# Altium schematic sheet Sheet1.SchDoc
size A1; SheetNumber: 1; SheetTotal: 1
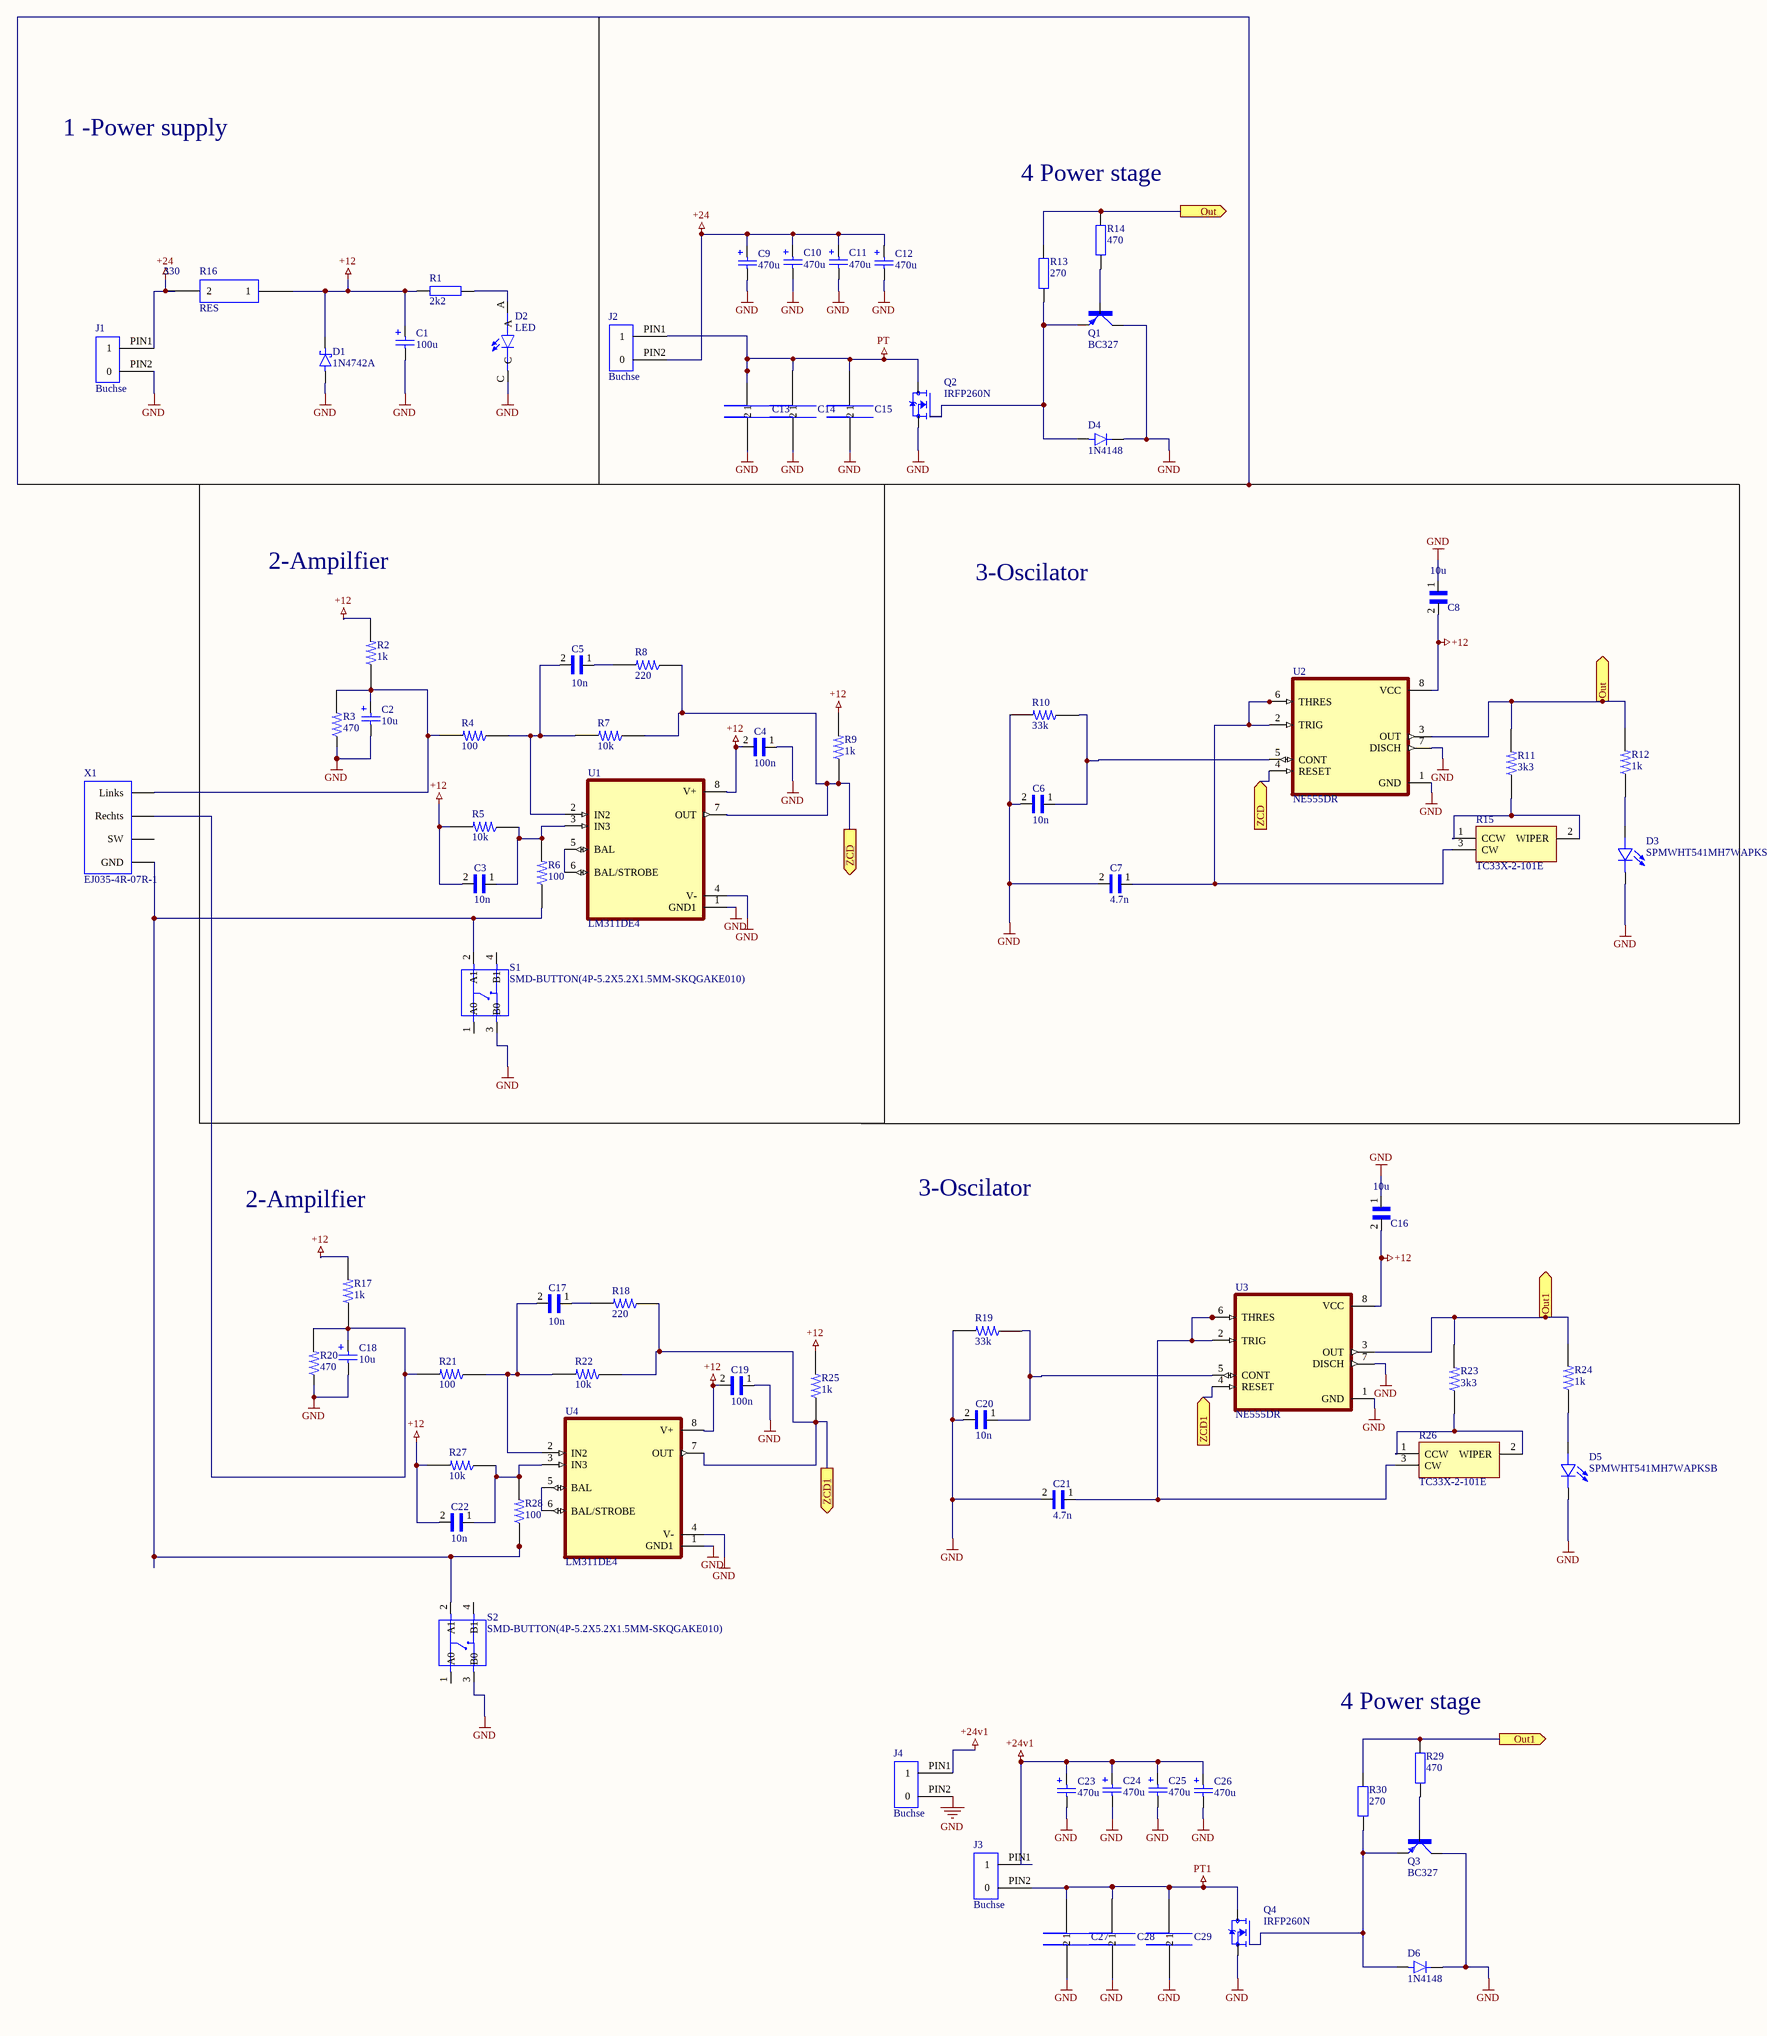
[diagram p0: Sheet1.SchDoc]

## Parts
C1  value 100u  [RB-.1/.2]  (hidden comment: ELKO)
C2  value 10u  [RB-.1/.2]  (hidden comment: ELKO)
C3  value 10n  [CAPC2012X135N]  (hidden comment: GCM21BR71H104KA37K)
C4  value 100n  [CAPC2012X135N]  (hidden comment: GCM21BR71H104KA37K)
C5  value 10n  [CAPC2012X135N]  (hidden comment: GCM21BR71H104KA37K)
C6  value 10n  [CAPC2012X135N]  (hidden comment: GCM21BR71H104KA37K)
C7  value 4.7n  [CAPC2012X135N]  (hidden comment: GCM21BR71H104KA37K)
C8  10u  [CAPC2012X135N]
C9  value 470u  [RB-.2/.4]  (hidden comment: ELKO)
C10  value 470u  [RB-.2/.4]  (hidden comment: ELKO)
C11  value 470u  [RB-.2/.4]  (hidden comment: ELKO)
C12  value 470u  [RB-.2/.4]  (hidden comment: ELKO)
C13  Kondensator  [Co]  (value not drawn)
C14  Kondensator  [Co]  (value not drawn)
C15  Kondensator  [Co]  (value not drawn)
C16  10u  [CAPC2012X135N]
C17  value 10n  [CAPC2012X135N]  (hidden comment: GCM21BR71H104KA37K)
C18  value 10u  [RB-.1/.2]  (hidden comment: ELKO)
C19  value 100n  [CAPC2012X135N]  (hidden comment: GCM21BR71H104KA37K)
C20  value 10n  [CAPC2012X135N]  (hidden comment: GCM21BR71H104KA37K)
C21  value 4.7n  [CAPC2012X135N]  (hidden comment: GCM21BR71H104KA37K)
C22  value 10n  [CAPC2012X135N]  (hidden comment: GCM21BR71H104KA37K)
C23  value 470u  [RB-.2/.4]  (hidden comment: ELKO)
C24  value 470u  [RB-.2/.4]  (hidden comment: ELKO)
C25  value 470u  [RB-.2/.4]  (hidden comment: ELKO)
C26  value 470u  [RB-.2/.4]  (hidden comment: ELKO)
C27  Kondensator  [Co]  (value not drawn)
C28  Kondensator  [Co]  (value not drawn)
C29  Kondensator  [Co]  (value not drawn)
D1  1N4742A  [DIOAD1036W78L463D272]
D2  LED  [LED_WP7113ID]
D3  SPMWHT541MH7WAPKSB  [LED_SPMWHT541MH7WAPKSB]
D4  1N4148  [DIOAD753W49L380D172B]
D5  SPMWHT541MH7WAPKSB  [LED_SPMWHT541MH7WAPKSB]
D6  1N4148  [DIOAD753W49L380D172B]
J1  Buchse  [Buchse1]
J2  Buchse  [Buchse1]
J3  Buchse  [Buchse1]
J4  Buchse  [Buchse1]
Q1  BC327  [SOT54A]
Q2  IRFP260N  [TO545P1560X500X2460-3]
Q3  BC327  [SOT54A]
Q4  IRFP260N  [TO545P1560X500X2460-3]
R1  value 2k2  [Axial-0.4]  (hidden comment: 1/8W)
R2  value 1k  [RESC1607X60N]  (hidden comment: RC0603FR-071ML)
R3  value 470  [RESC1607X60N]  (hidden comment: RC0603FR-071ML)
R4  value 100  [RESC1607X60N]  (hidden comment: RC0603FR-071ML)
R5  value 10k  [RESC1607X60N]  (hidden comment: RC0603FR-071ML)
R6  value 100  [RESC1607X60N]  (hidden comment: RC0603FR-071ML)
R7  value 10k  [RESC1607X60N]  (hidden comment: RC0603FR-071ML)
R8  value 220  [RESC1607X60N]  (hidden comment: RC0603FR-071ML)
R9  value 1k  [RESC1607X60N]  (hidden comment: RC0603FR-071ML)
R10  value 33k  [RESC1607X60N]  (hidden comment: RC0603FR-071ML)
R11  value 3k3  [RESC1607X60N]  (hidden comment: RC0603FR-071ML)
R12  value 1k  [RESC1607X60N]  (hidden comment: RC0603FR-071ML)
R13  value 270  [Axial-0.4]  (hidden comment: 1/4W)
R14  value 470  [Axial-0.4]  (hidden comment: 1/8W)
R15  TC33X-2-101E  [TC33X2503E]
R16  RES  VALUE=: 330  [PCBComponent_1]
R17  value 1k  [RESC1607X60N]  (hidden comment: RC0603FR-071ML)
R18  value 220  [RESC1607X60N]  (hidden comment: RC0603FR-071ML)
R19  value 33k  [RESC1607X60N]  (hidden comment: RC0603FR-071ML)
R20  value 470  [RESC1607X60N]  (hidden comment: RC0603FR-071ML)
R21  value 100  [RESC1607X60N]  (hidden comment: RC0603FR-071ML)
R22  value 10k  [RESC1607X60N]  (hidden comment: RC0603FR-071ML)
R23  value 3k3  [RESC1607X60N]  (hidden comment: RC0603FR-071ML)
R24  value 1k  [RESC1607X60N]  (hidden comment: RC0603FR-071ML)
R25  value 1k  [RESC1607X60N]  (hidden comment: RC0603FR-071ML)
R26  TC33X-2-101E  [TC33X2503E]
R27  value 10k  [RESC1607X60N]  (hidden comment: RC0603FR-071ML)
R28  value 100  [RESC1607X60N]  (hidden comment: RC0603FR-071ML)
R29  value 470  [Axial-0.4]  (hidden comment: 1/8W)
R30  value 270  [Axial-0.4]  (hidden comment: 1/4W)
S1  SMD-BUTTON(4P-5.2X5.2X1.5MM-SKQGAKE010)  [SW4-SMD-5.2X5.2X1.5MM]
S2  SMD-BUTTON(4P-5.2X5.2X1.5MM-SKQGAKE010)  [SW4-SMD-5.2X5.2X1.5MM]
U1  LM311DE4  [SOIC127P599X175-8N]
U2  NE555DR  [SOIC127P599X175-8N]
U3  NE555DR  [SOIC127P599X175-8N]
U4  LM311DE4  [SOIC127P599X175-8N]
X1  EJ035-4R-07R-1  [EJ035-4R-07R-1]

## Ports
Out1 (out), Out (out), ZCD1 (in), ZCD1 (out), ZCD (in), ZCD (out)

## Nets
+12: C1.1 C3.2 C4.2 C8.2 C16.2 C19.2 C22.2 D1.1(K) R1.1 R2.2 R5.2 R9.2 R16.PIN1(1) R17.2 R25.2 R27.2 U1.8(V+) U2.8(VCC) U3.8(VCC) U4.8(V+)
+24: C9.1 C10.1 C11.1 C12.1 J1.PIN1(1) J2.PIN2(0) R16.PIN2(2)
+24v1: C23.1 C24.1 C25.1 C26.1 J3.PIN1(1) J4.PIN1(1)
GND: C1.2 C2.2 C4.1 C6.2 C7.2 C8.1 C9.2 C10.2 C11.2 C12.2 C13.PIN1(1) C14.PIN1(1) C15.PIN1(1) C16.1 C18.2 C19.1 C20.2 C21.2 C23.2 C24.2 C25.2 C26.2 C27.PIN1(1) C28.PIN1(1) C29.PIN1(1) D1.2(A) D2.C D3.C D4.K D5.C D6.K J1.PIN2(0) J4.PIN2(0) Q1.C Q2.3(S) Q3.C Q4.3(S) R3.1 R10.2 R19.2 R20.1 S1.3(B0) S2.3(B0) U1.1(GND1) U1.4(V-) U2.1(GND) U2.7(DISCH) U3.1(GND) U3.7(DISCH) U4.1(GND1) U4.4(V-)
PT: C13.PIN2(2) C14.PIN2(2) C15.PIN2(2) J2.PIN1(1) Q2.2(D)
PT1: C27.PIN2(2) C28.PIN2(2) C29.PIN2(2) J3.PIN2(0) Q4.2(D)
Out: R11.2 R12.2 R13.2 R14.2 U2.3(OUT) ; port Out
Out1: R23.2 R24.2 R29.2 R30.2 U3.3(OUT) ; port Out1
ZCD: R7.1 R8.1 R9.1 U1.7(OUT) U2.4(RESET) ; port ZCD
ZCD1: R18.1 R22.1 R25.1 U3.4(RESET) U4.7(OUT) ; port ZCD1
NetC2_1: C2.1 R2.1 R3.2 R4.2 X1.L(Links)
NetC3_1: C3.1 R5.1 R6.2 U1.3(IN3)
NetC5_1: C5.1 R8.2
NetC5_2: C5.2 R4.1 R7.2 U1.2(IN2)
NetC6_1: C6.1 R10.1 U2.5(CONT)
NetC7_1: C7.1 R15.3(CW) U2.2(TRIG) U2.6(THRES)
NetC17_1: C17.1 R18.2
NetC17_2: C17.2 R21.1 R22.2 U4.2(IN2)
NetC18_1: C18.1 R17.1 R20.2 R21.2 X1.R(Rechts)
NetC20_1: C20.1 R19.1 U3.5(CONT)
NetC21_1: C21.1 R26.3(CW) U3.2(TRIG) U3.6(THRES)
NetC22_1: C22.1 R27.1 R28.2 U4.3(IN3)
NetD2_A: D2.A R1.2
NetD3_A: D3.A R12.1
NetD4_A: D4.A Q1.E Q2.1(G) R13.1
NetD5_A: D5.A R24.1
NetD6_A: D6.A Q3.E Q4.1(G) R30.1
NetQ1_B: Q1.B R14.1
NetQ3_B: Q3.B R29.1
NetR6_1: R6.1 R28.1 S1.2(A1) S2.2(A1) X1.GND
NetR11_1: R11.1 R15.1(CCW) R15.2(WIPER)
NetR23_1: R23.1 R26.1(CCW) R26.2(WIPER)
NetU1_5: U1.5(BAL) U1.6(BAL/STROBE)
NetU4_5: U4.5(BAL) U4.6(BAL/STROBE)

Not connected (* = marked no-connect by the designer): S1 1(A0) 4(B1); S2 1(A0) 4(B1); X1 SW

## Notes on the sheet
- 1 -Power supply
- (near R14) 4 Power stage
- 2-Ampilfier
- 3-Oscilator
- (near R29) 4 Power stage

## Library data of the parts
C3 C4 C6-C8 C16 C19-C22 = GCM21BR71H104KA37K: SMD Capacitor X7R(EIA) with Capacitance: 0.10uF Tol. 10%. Rated Voltage: 50Vdc; MF: Murata; SnapEDA_Link: https://www.snapeda.com/parts/GCM21BR71H104KA37K/Murata%20Electronics%20North%20America/view-part/1764792/?ref=snap; MP: GCM21BR71H104KA37K; Price: None; Arrow_Electronics-Purchase-URL: https://snapeda.com/shop?store=Arrow+Electronics&id=1764792; Availability: Good; Package: 0805 Murata; DigiKey-Purchase-URL: https://snapeda.com/shop?store=DigiKey&id=1764792; Check_prices: https://www.snapeda.com/parts/GCM21BR71H104KA37K/Murata%20Electronics%20North%20America/view-part/1764792/?ref=eda
  C8 C16: Value: 10u
C5 C17 = GCM21BR71H104KA37K: MF: Murata; SnapEDA_Link: https://www.snapeda.com/parts/GCM21BR71H104KA37K/Murata%20Electronics%20North%20America/view-part/1764792/?ref=snap; MP: GCM21BR71H104KA37K; Price: None; Arrow_Electronics-Purchase-URL: https://snapeda.com/shop?store=Arrow+Electronics&id=1764792; Availability: Good; Package: 0805 Murata; DigiKey-Purchase-URL: https://snapeda.com/shop?store=DigiKey&id=1764792; Check_prices: https://www.snapeda.com/parts/GCM21BR71H104KA37K/Murata%20Electronics%20North%20America/view-part/1764792/?ref=eda
D1 = 1N4742A: Zener Diode 12 V 1 W Â±5% Through Hole DO-41; MF: ON; SnapEDA_Link: https://www.snapeda.com/parts/1N4742A/Onsemi/view-part/?ref=snap; Package: DO-41 ON Semiconductor; Value: *; MP: 1N4742A; Check_prices: https://www.snapeda.com/parts/1N4742A/Onsemi/view-part/?ref=eda
D2 = WP7113ID: Red 617nm LED Indication - Discrete 2V Radial; Value: Green; MF: Kingbright; Price: None; MP: WP7113ID; Package: Radial Kingbright; Check_prices: https://www.snapeda.com/parts/WP7113ID/Kingbright/view-part/?ref=eda; Purchase-URL: https://pricing.snapeda.com/search/part/WP7113ID/?ref=eda; Availability: In Stock; SnapEDA_Link: https://www.snapeda.com/parts/WP7113ID/Kingbright/view-part/?ref=snap
D3 D5 = SPMWHT541MH7WAPKSB: LED LM561B PLUS WHITE 5630; MF: Samsung Semiconductor, Inc.; SnapEDA_Link: https://www.snapeda.com/parts/SPMWHT541MH7WAPKSB/Samsung+Semiconductor%252C+Inc./view-part/?ref=snap; Package: None; Value: *; MP: SPMWHT541MH7WAPKSB; Check_prices: https://www.snapeda.com/parts/SPMWHT541MH7WAPKSB/Samsung+Semiconductor%252C+Inc./view-part/?ref=eda
Q1 Q3 = BC327: Bipolar (BJT) Transistor PNP 45V 800mA 260MHz 625mW Through Hole TO-92 (TO-226); MF: ON Semiconductor; Check_prices: https://www.snapeda.com/parts/BC327/Onsemi/view-part/?ref=eda; Value: *; Availability: In Stock; MP: BC327; Price: None; Package: E-PKG AXIAL-LEADED-2 ON Semiconductor; SnapEDA_Link: https://www.snapeda.com/parts/BC327/Onsemi/view-part/?ref=snap; Purchase-URL: https://pricing.snapeda.com/search/part/BC327/?ref=eda
Q2 Q4 = IRFP260N: N-Channel 200V 50A (Tc) 300W (Tc) Through Hole TO-247AC; MF: Infineon Technologies; Check_prices: https://www.snapeda.com/parts/IRFP260N/Infineon%20Technologies/view-part/2777552/?ref=eda; SnapEDA_Link: https://www.snapeda.com/parts/IRFP260N/Infineon%20Technologies/view-part/2777552/?ref=snap; MP: IRFP260N; Availability: Unavailable; Value: *; Price: None; Package: TO-247-3 Infineon Technologies
R1 R13 R14 R29 R30 = RES: Widerstand
R2-R12 R17-R25 R27 R28 = RC0603FR-071ML: Thick film general purpose; MF: {'manufacturer': u'YAGEO'}; Package: None; Price: None; MP: RC0603FR-071ML; Availability: Unavailable
R15 R26 = TC33X-2-101E: Resistor; Manufacturer_Name: Bourns; Datasheet Link: https://www.bourns.com/pdfs/TC33.pdf; Height: 1.2mm; Manufacturer_Part_Number: TC33X-2-101E; Mouser Part Number: 652-TC33X-2-101E; Mouser Price/Stock: https://www.mouser.co.uk/ProductDetail/Bourns/TC33X-2-101E/?qs=Y%252BBfgPVcerSfRO2kwQB%2F8g%3D%3D; Arrow Part Number: TC33X-2-101E; Arrow Price/Stock: https://www.arrow.com/en/products/tc33x-2-101e/bourns?region=nac
S1 S2 = SMD-BUTTON(4P-5.2X5.2X1.5MM-SKQGAKE010): Switch Tactile N.O. SPST Button Gull Wing 0.05A 12VDC 3.43N SMD T/R; MF: ALPS; SnapEDA_Link: https://www.snapeda.com/parts/SKQGAKE010/ALPS/view-part/51324/?ref=snap; MP: SKQGAKE010; Price: None; Package: None; Value: *; Availability: Unavailable
U1 U4 = LM311DE4: High Speed, 30V, Differential Comparator With Strobes 8-SOIC 0 to 70; MF: Texas Instruments; MP: LM311DE4; Package: SOIC-8 Texas Instruments; SnapEDA_Link: https://www.snapeda.com/parts/LM311DE4/Texas+Instruments/view-part/?ref=snap; Check_prices: https://www.snapeda.com/parts/LM311DE4/Texas+Instruments/view-part/?ref=eda; Value: *; Purchase-URL: https://pricing.snapeda.com/search/part/LM311DE4/?ref=eda; Digi-Key_Part_Number: 2156-LM311DE4-ND
U2 U3 = NE555DR: MF: {'manufacturer': u'Texas Instruments'}; Package: None; Price: None; Value: *; MP: NE555DR; Availability: Unavailable
X1 = 3.5mm Klinke Stereo: HTL-Schnorr-Elektronik
D4 D6 = 1N4148: Package: None; Price: None; Value: *; MP: 1N4148; Availability: Unavailable